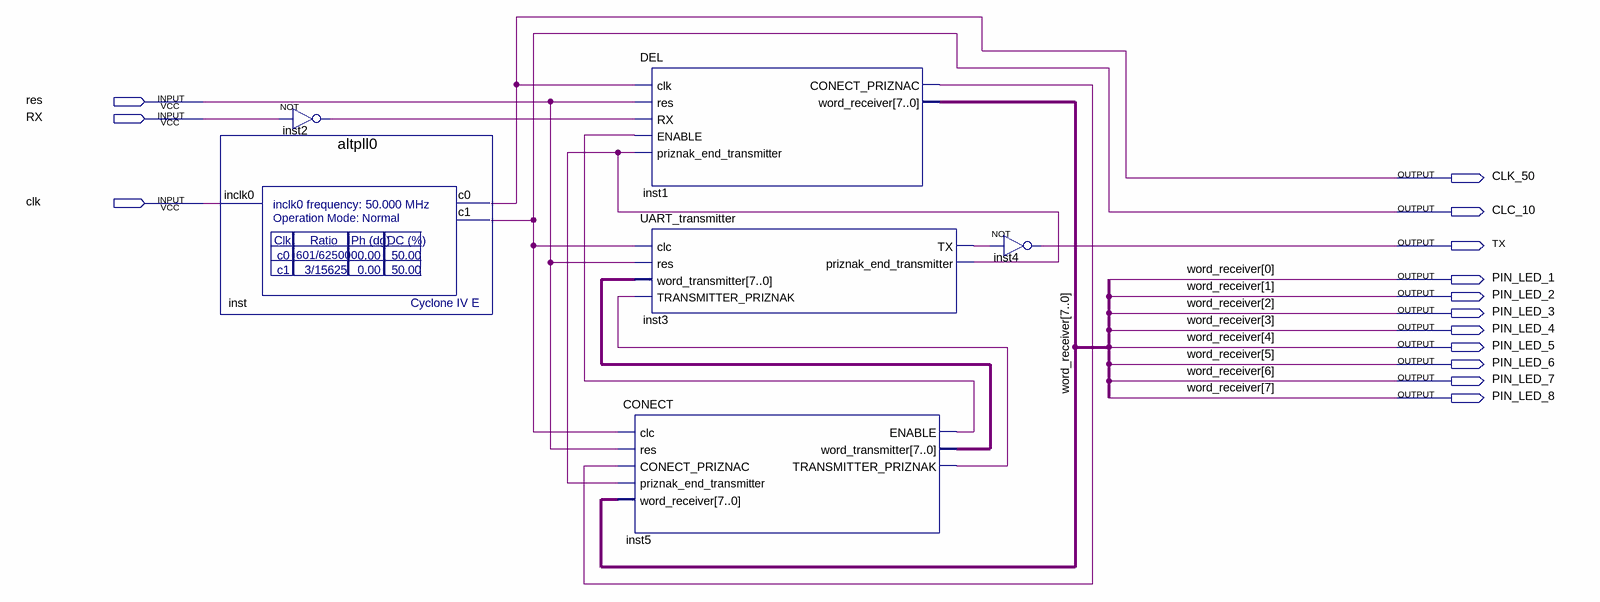
[diagram p0: schematic sheet]
// Quartus schematic all_uart.bdf as structural Verilog: 6 symbols, 14 pins
module all_uart (
  input  res,
  input  RX,
  input  clk,
  output CLK_50,
  output CLC_10,
  output TX,
  output PIN_LED_1,
  output PIN_LED_2,
  output PIN_LED_3,
  output PIN_LED_4,
  output PIN_LED_5,
  output PIN_LED_6,
  output PIN_LED_7,
  output PIN_LED_8
);

  wire inst1_conect_priznac, inst2_out, inst3_priznak_end_transmitter, inst3_tx, inst5_enable,
       inst5_transmitter_priznak;
  wire [7:0] inst5_word_transmitter;

  altpll0 inst (.inclk0(clk), .c0(CLK_50), .c1(CLC_10));
  not inst2 (inst2_out, RX);
  DEL inst1 (
    .clk(CLK_50), .res(res), .RX(inst2_out), .ENABLE(inst5_enable),
    .priznak_end_transmitter(inst3_priznak_end_transmitter), .CONECT_PRIZNAC(inst1_conect_priznac),
    .word_receiver({PIN_LED_8, PIN_LED_7, PIN_LED_6, PIN_LED_5, PIN_LED_4, PIN_LED_3, PIN_LED_2, PIN_LED_1}));
  UART_transmitter inst3 (
    .clc(CLC_10), .res(res), .word_transmitter(inst5_word_transmitter),
    .TRANSMITTER_PRIZNAK(inst5_transmitter_priznak), .TX(inst3_tx),
    .priznak_end_transmitter(inst3_priznak_end_transmitter));
  CONECT inst5 (
    .clc(CLC_10), .res(res), .CONECT_PRIZNAC(inst1_conect_priznac),
    .priznak_end_transmitter(inst3_priznak_end_transmitter),
    .word_receiver({PIN_LED_8, PIN_LED_7, PIN_LED_6, PIN_LED_5, PIN_LED_4, PIN_LED_3, PIN_LED_2, PIN_LED_1}),
    .ENABLE(inst5_enable), .word_transmitter(inst5_word_transmitter),
    .TRANSMITTER_PRIZNAK(inst5_transmitter_priznak));
  not inst4 (TX, inst3_tx);

  // Other names for the same wires on the sheet: word_receiver[7:0] = {PIN_LED_8, PIN_LED_7, PIN_LED_6, PIN_LED_5, PIN_LED_4, PIN_LED_3, PIN_LED_2, PIN_LED_1}
endmodule
